# EAGLE design v1 (EAGLE 9.5.2)
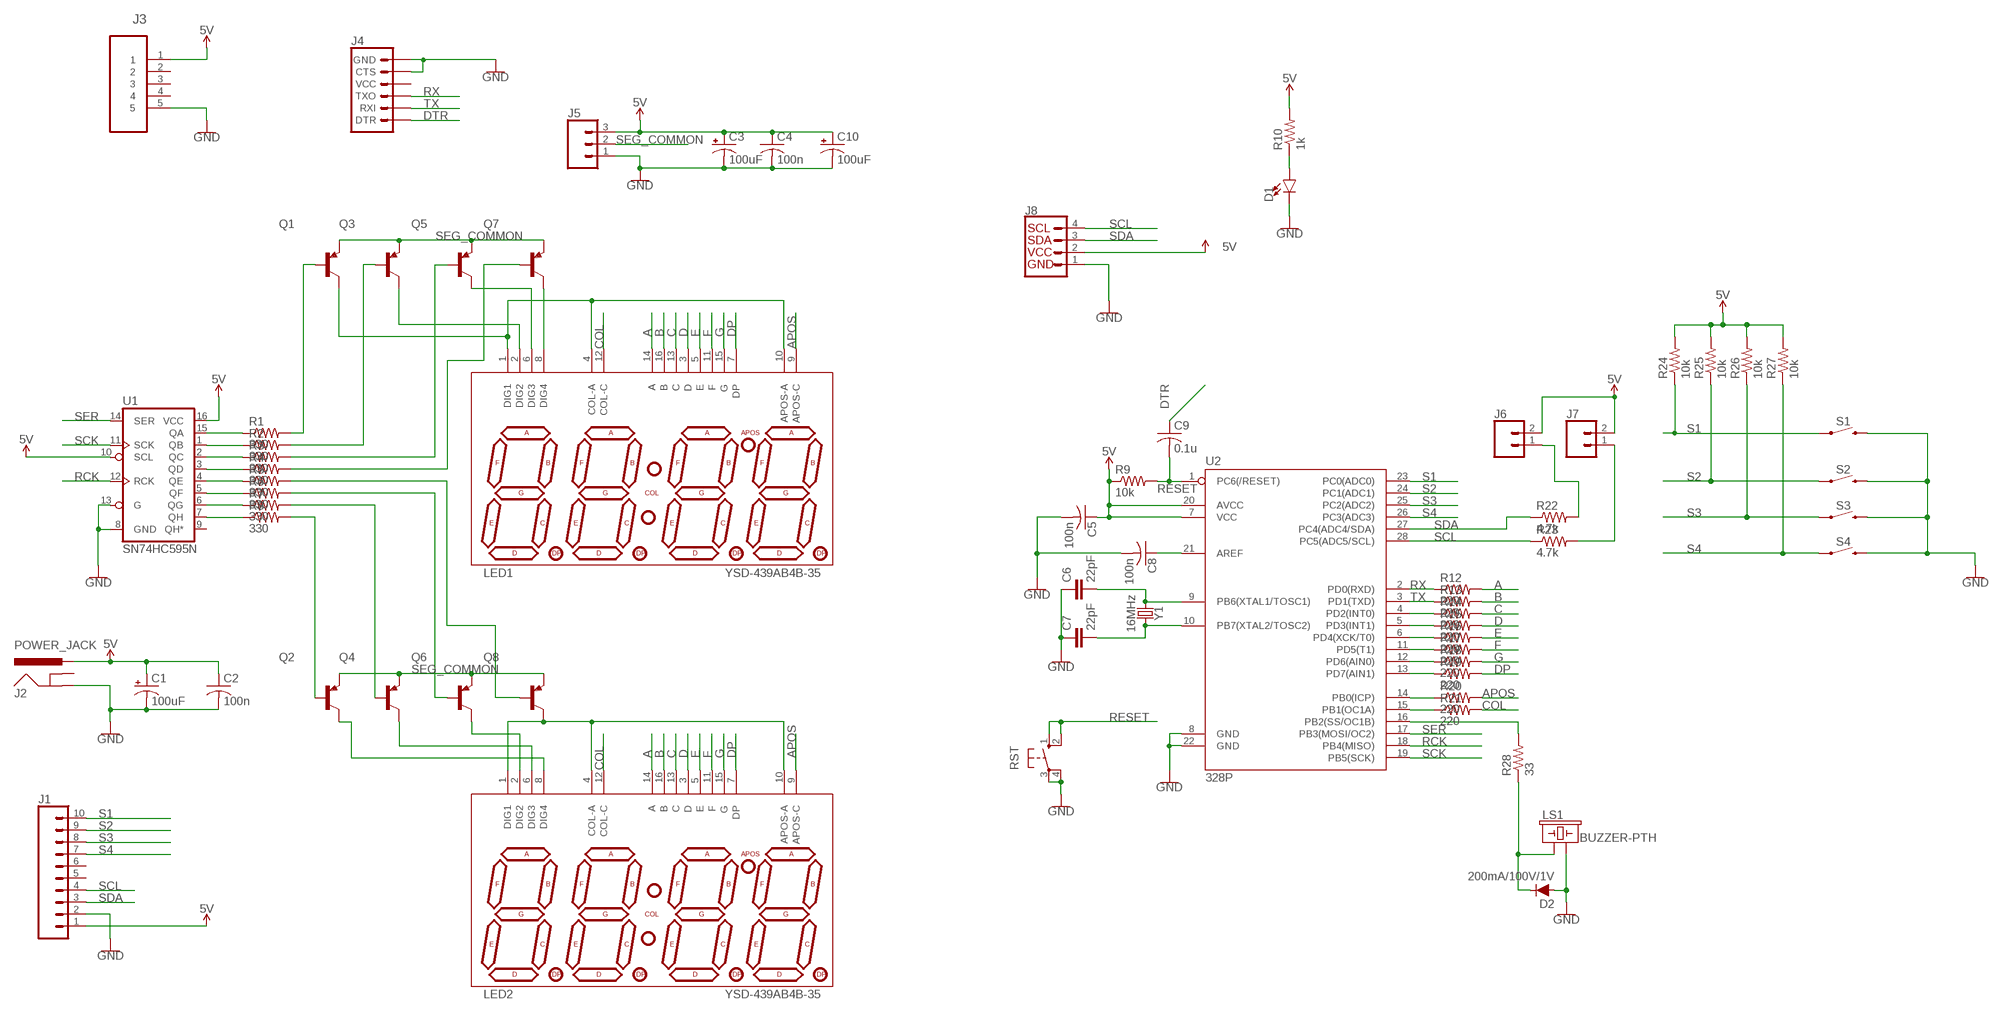
[diagram p0: schematic, sheet 1]

## Parts
C1  100uF  100UF-POLAR-RADIAL-2.5MM-25V-20%  [CPOL-RADIAL-2.5MM-6.5MM]
C2  100n  C-US025-025X050  [C025-025X050]
C3  100uF  100UF-POLAR-RADIAL-2.5MM-25V-20%  [CPOL-RADIAL-2.5MM-6.5MM]
C4  100n  C-US025-025X050  [C025-025X050]
C5  100n  C-US025-025X050  [C025-025X050]
C6  22pF  22PF-PTH-2.54MM-200V-5%  [CAP-PTH-2.54]
C7  22pF  22PF-PTH-2.54MM-200V-5%  [CAP-PTH-2.54]
C8  100n  C-US025-025X050  [C025-025X050]
C9  0.1u  C-US025-025X050  [C025-025X050]
C10  100uF  100UF-POLAR-RADIAL-2.5MM-25V-20%  [CPOL-RADIAL-2.5MM-6.5MM]
D1  LED3MM  [LED_3MM]
D2  200mA/100V/1V  DIODE-1N4148  [DIODE-1N4148]
J1  CONN_10"  [1X10]
J2  POWER_JACK  [POWER_JACK_PTH]
J3  47346-0001  [MOLEX_47346-0001]
J4  6_PIN_SERIAL_TARGET  [1X06]
J5  CONN_03  [1X03]
J6  CONN_02  [1X02]
J7  CONN_02  [1X02]
J8  I2C_STANDARD  [1X04]
LED1  YSD-439AB4B-35  7-SEGMENT-4DIGIT-10MM-BLUE  [7-SEGMENT-4DIGIT-YOUNGSUN]
LED2  YSD-439AB4B-35  7-SEGMENT-4DIGIT-10MM-BLUE  [7-SEGMENT-4DIGIT-YOUNGSUN]
LS1  BUZZER-PTH  [BUZZER-12MM]
Q1  2N3906  [TO92]
Q2  2N3906  [TO92]
Q3  2N3906  [TO92]
Q4  2N3906  [TO92]
Q5  2N3906  [TO92]
Q6  2N3906  [TO92]
Q7  2N3906  [TO92]
Q8  2N3906  [TO92]
R1  330  R-US_0204/5  [0204/5]
R2  330  R-US_0204/5  [0204/5]
R3  330  R-US_0204/5  [0204/5]
R4  330  R-US_0204/5  [0204/5]
R5  330  R-US_0204/5  [0204/5]
R6  330  R-US_0204/5  [0204/5]
R7  330  R-US_0204/5  [0204/5]
R8  330  R-US_0204/5  [0204/5]
R9  10k  R-US_0204/5  [0204/5]
R10  1k  R-US_0204/5  [0204/5]
R12  220  R-US_0204/5  [0204/5]
R13  220  R-US_0204/5  [0204/5]
R14  220  R-US_0204/5  [0204/5]
R15  220  R-US_0204/5  [0204/5]
R16  220  R-US_0204/5  [0204/5]
R17  220  R-US_0204/5  [0204/5]
R18  220  R-US_0204/5  [0204/5]
R19  220  R-US_0204/5  [0204/5]
R20  220  R-US_0204/5  [0204/5]
R21  220  R-US_0204/5  [0204/5]
R22  4.7k  R-US_0204/5  [0204/5]
R23  4.7k  R-US_0204/5  [0204/5]
R24  10k  R-US_0204/5  [0204/5]
R25  10k  R-US_0204/5  [0204/5]
R26  10k  R-US_0204/5  [0204/5]
R27  10k  R-US_0204/5  [0204/5]
R28  33  R-US_0204/5  [0204/5]
RST  10-XX  [B3F-10XX]
S1  MOMENTARY-SWITCH-SPST-PTH-6.0MM  [TACTILE_SWITCH_PTH_6.0MM]
S2  MOMENTARY-SWITCH-SPST-PTH-6.0MM  [TACTILE_SWITCH_PTH_6.0MM]
S3  MOMENTARY-SWITCH-SPST-PTH-6.0MM  [TACTILE_SWITCH_PTH_6.0MM]
S4  MOMENTARY-SWITCH-SPST-PTH-6.0MM  [TACTILE_SWITCH_PTH_6.0MM]
U1  SN74HC595N  74HC595N  [DIP16]
U2  328P  ATMEGA328P_PDIP  [DIP28]
Y1  16MHz  CRYSTAL-16MHZPTH-HC49US  [HC49US]

## Nets
5V [SUPPLY]: C1.1(+) C2.1 C3.1(+) C4.1 C5.1 C10.1(+) J1.1 J2.PWR J3.1 J5.3 J6.2 J7.2 J8.2 R9.1 R10.2 R24.2 R25.2 R26.2 R27.2 U1.10(SCL) U1.16(VCC) U2.7(VCC) U2.20(AVCC)
A: LED1.14(A) LED2.14(A) R12.2
APOS: LED1.9(APOS-C) LED2.9(APOS-C) R20.2
B: LED1.16(B) LED2.16(B) R13.2
C: LED1.13(C) LED2.13(C) R14.2
COL: LED1.12(COL-C) LED2.12(COL-C) R21.2
D: LED1.3(D) LED2.3(D) R15.2
DP: LED1.7(DP) LED2.7(DP) R19.2
DTR: C9.1 J4.1(DTR)
E: LED1.5(E) LED2.5(E) R16.2
F: LED1.11(F) LED2.11(F) R17.2
G: LED1.15(G) LED2.15(G) R18.2
GND [SUPPLY]: C1.2(-) C2.2 C3.2(-) C4.2 C5.2 C6.1 C7.1 C8.2 C10.2(-) D1.K(C) D2.A J1.2 J2.GND J3.5 J4.5(CTS) J4.6(GND) J5.1 J8.1 LS1.- RST.3(P) RST.4(P1) S1.3 S2.3 S3.3 S4.3 U1.8(GND) U1.13(G) U2.8(GND) U2.22(GND)
N$1: D1.A R10.1
N$2: R21.1 U2.15(PB1(OC1A))
N$3: R14.1 U2.4(PD2(INT0))
N$4: R15.1 U2.5(PD3(INT1))
N$5: R16.1 U2.6(PD4(XCK/T0))
N$6: R17.1 U2.11(PD5(T1))
N$7: R18.1 U2.12(PD6(AIN0))
N$8: R19.1 U2.13(PD7(AIN1))
N$9: C6.2 U2.9(PB6(XTAL1/TOSC1)) Y1.1
N$10: C7.2 U2.10(PB7(XTAL2/TOSC2)) Y1.2
N$11: LED1.1(DIG1) LED1.4(COL-A) LED1.10(APOS-A) Q1.1(C)
N$12: LED1.6(DIG3) Q5.1(C)
N$13: LED1.2(DIG2) Q3.1(C)
N$14: R28.2 U2.16(PB2(SS/OC1B))
N$15: LED2.1(DIG1) LED2.4(COL-A) LED2.10(APOS-A) Q8.1(C)
N$16: D2.C LS1.+ R28.1
N$17: LED2.2(DIG2) Q6.1(C)
N$18: LED2.6(DIG3) Q4.1(C)
N$19: LED2.8(DIG4) Q2.1(C)
N$20: LED1.8(DIG4) Q7.1(C)
N$21: Q1.2(B) R1.2
N$22: Q3.2(B) R2.2
N$23: Q5.2(B) R3.2
N$24: Q7.2(B) R4.2
N$25: Q8.2(B) R5.2
N$26: Q6.2(B) R6.2
N$27: Q4.2(B) R7.2
N$28: Q2.2(B) R8.2
N$29: R1.1 U1.15(QA)
N$30: R2.1 U1.1(QB)
N$31: R3.1 U1.2(QC)
N$32: R4.1 U1.3(QD)
N$33: R5.1 U1.4(QE)
N$34: R6.1 U1.5(QF)
N$35: R7.1 U1.6(QG)
N$36: R8.1 U1.7(QH)
N$37: C8.1 U2.21(AREF)
N$39: J6.1 R22.2
N$40: J7.1 R23.2
N$46: R20.1 U2.14(PB0(ICP))
RCK: U1.12(RCK) U2.18(PB4(MISO))
RESET: C9.2 R9.2 RST.1(S) RST.2(S1) U2.1(PC6(/RESET))
RX: J4.3(TXO) R12.1 U2.2(PD0(RXD))
S1: J1.10 R24.1 S1.1 U2.23(PC0(ADC0))
S2: J1.9 R25.1 S2.1 U2.24(PC1(ADC1))
S3: J1.8 R26.1 S3.1 U2.25(PC2(ADC2))
S4: J1.7 R27.1 S4.1 U2.26(PC3(ADC3))
SCK: U1.11(SCK) U2.19(PB5(SCK))
SCL: J1.4 J8.4 R23.1 U2.28(PC5(ADC5/SCL))
SDA: J1.3 J8.3 R22.1 U2.27(PC4(ADC4/SDA))
SEG_COMMON [SUPPLY]: J5.2 Q1.3(E) Q2.3(E) Q3.3(E) Q4.3(E) Q5.3(E) Q6.3(E) Q7.3(E) Q8.3(E)
SER: U1.14(SER) U2.17(PB3(MOSI/OC2))
TX: J4.2(RXI) R13.1 U2.3(PD1(TXD))
Unconnected: J1.5 J1.6 J2.GNDBREAK J3.2 J3.3 J3.4 J4.4(VCC) U1.9(QH*)

## Library data of the parts
C1 C3 C10 = SparkFun-Capacitors:100UF-POLAR: 100µF polarized capacitors A capacitor is a passive two-terminal electrical component used to store electrical energy temporarily in an electric field.; PROD_ID: CAP-08439
C2 C4 C5 C8 C9 = adafruit:C-US: CAPACITOR, American symbol
C6 C7 = SparkFun-Capacitors:22PF: 22pF ceramic capacitors A capacitor is a passive two-terminal electrical component used to store electrical energy temporarily in an electric field.; PROD_ID: CAP-09128
D1 = SparkFun-LED:LED: LED (Generic) Standard schematic elements and footprints for 5mm, 3mm, 1206, and 0603 sized LEDs. Generic LEDs with no color specified.; PROD_ID: DIO-08794
D2 = SparkFun-DiscreteSemi:DIODE: Diode These are standard reverse protection diodes and small signal diodes. SparkFun Products: SparkFun SparkPunk Sound Kit <https://www.sparkfun.com/products/11177> SparkFun ESP8266 Thing <https://www.sparkfun.com/products/13231>; PROD_ID: DIO-08378
J1 = SparkFun-Connectors:CONN_10: Multi connection point. Often used as Generic Header-pin footprint for 0.1 inch spaced/style header connections On any of the 0.1 inch spaced packages, you can populate with these: Break Away Headers - Straight <https://www.sparkfun.com/products/116> (PRT-00116) Break Away Male Headers - Right Angle <https://www.sparkfun.com/products/553> (PRT-00553) Female Headers <https://www.sparkfun.com/products/115> (PRT-00115) Break Away Headers - Machine Pin <https://www.sparkfun.com/products/117> (PRT-00117) Break Away Female Headers - Swiss Machine Pin <https://www.sparkfun.com/products/743> (PRT-00743) Arduino Stackable Header - 10 Pin <https://www.sparkfun.com/products/11376> (PRT-11376) For SCREWTERMINALS and SPRING TERMINALS visit here: Screw Terimnals on SparkFun.com <https://www.sparkfun.com/search/results?term=Screw+Terminals> (5mm/3.5mm/2.54mm spacing) This device is also useful as a general connection point to wire up your design to another part of your project. Our various solder wires solder well into these plated through hole pads. Hook-Up Wire - Assortment (Stranded, 22 AWG) <https://www.sparkfun.com/products/11375> (PRT-11375) Hook-Up Wire - Assortment (Solid Core, 22 AWG) <https://www.sparkfun.com/products/11367> (PRT-11367) View the entire wire category on our website here <https://www.sparkfun.com/categories/141> Special notes: Molex polarized connector foot print use with SKU : PRT-08231 with associated crimp pins and housings. 1MM SMD Version SKU: PRT-10208 NOTES ON THE VARIANTS LOCK and LOCK_LONGPADS... This footprint was designed to help hold the alignment of a through-hole component (i.e. 6-pin header) while soldering it into place. You may notice that each hole has been shifted either up or down by 0.005 of an inch from it's more standard position (which is a perfectly straight line). This slight alteration caused the pins (the squares in the middle) to touch the edges of the holes. Because they are alternating, it causes a "brace" to hold the component in place. 0.005 has proven to be the perfect amount of "off-center" position when using our standard breakaway headers. Although looks a little odd when you look at the bare footprint, once you have a header in there, the alteration is very hard to notice. Also,if you push a header all the way into place, it is covered up entirely on the bottom side.; PROD_ID: CONN-11563
J2 = SparkFun-Connectors:POWER_JACK: Power Jack Connector This is the standard 5.5mm barrel jack for power. The PTH is the most common, proven, reliable, footprint. The Slot footprint only works if the mill layer is transmitted to the PCB fab house so be warned. Here are the connectors we sell at SparkFun: DC Barrel Power Jack/Connector <https://www.sparkfun.com/products/119> (PRT-00119) DC Barrel Power Jack/Connector (SMD) <https://www.sparkfun.com/products/12748> (PRT-12748) DC Barrel Jack Adapter - Breadboard Compatible <https://www.sparkfun.com/products/10811> (PRT-10811) It is used on this SparkFun product (and many, many others): SparkFun RedBoard - Programmed with Arduino <https://www.sparkfun.com/products/12757> (DEV-12757) Also, if you need a mating power supply or connector, please check these out: Wall Adapter Power Supply - 9VDC 650mA <https://www.sparkfun.com/products/298> (TOL-00298) DC Barrel Jack Adapter - Male <https://www.sparkfun.com/products/10287> (PRT-10287); PROD_ID: CONN-08197
J3 = Molex-47346-0001:47346-0001: CONN RCPT 5POS MICRO USB R/A SMD; MPN: 47346-0001; OC_FARNELL: 1568026; OC_NEWARK: 47M0505; PACKAGE: 5 POS MICRO USB R/A; SUPPLIER: MOLEX
J4 = SparkFun-Connectors:6_PIN_SERIAL_TARGET: 6-pin header connection for use with the "FTDI BASIC" pinout - TARGET SIDE. Also known as "Arduino Serial Program Header". It is used to mate with our FTDI Basic serial programmers using the Arduino IDE. Note, this device has "TARGET" in the name. It is intended to be used on a design that contains a target micro-controller that you wish to program. The "sister" device, named "CABLE" is inteneded to be used on a design that usually lives on the end of your USB cable and prvides the converter chip (FTDI232 or FTDI231x) to commnicate serial RX/TX. You can populate with some of these: Break Away Headers - Straight <https://www.sparkfun.com/products/116> (PRT-00116) For reference (or to suit your programming needs) check out these designs: SparkFun FTDI Basic Breakout - 5V <https://www.sparkfun.com/products/9716> (DEV-09716) SparkFun FTDI Basic Breakout - 3.3V <https://www.sparkfun.com/products/9873> (DEV-09873) SparkFun FTDI SmartBasic <https://www.sparkfun.com/products/12935> (DEV-12935) SparkFun Beefy 3 - FTDI Basic Breakout <https://www.sparkfun.com/products/13746> (DEV-13746)
J5 = SparkFun-Connectors:CONN_03: Multi connection point. Often used as Generic Header-pin footprint for 0.1 inch spaced/style header connections On any of the 0.1 inch spaced packages, you can populate with these: Break Away Headers - Straight <https://www.sparkfun.com/products/116> (PRT-00116) Break Away Male Headers - Right Angle <https://www.sparkfun.com/products/553> (PRT-00553) Female Headers <https://www.sparkfun.com/products/115> (PRT-00115) Break Away Headers - Machine Pin <https://www.sparkfun.com/products/117> (PRT-00117) Break Away Female Headers - Swiss Machine Pin <https://www.sparkfun.com/products/743> (PRT-00743) Stackable Header - 3 Pin (Female, 0.1") <https://www.sparkfun.com/products/13875> (PRT-13875) For SCREWTERMINALS and SPRING TERMINALS visit here: Screw Terimnals on SparkFun.com <https://www.sparkfun.com/search/results?term=Screw+Terminals> (5mm/3.5mm/2.54mm spacing) This device is also useful as a general connection point to wire up your design to another part of your project. Our various solder wires solder well into these plated through hole pads. Hook-Up Wire - Assortment (Stranded, 22 AWG) <https://www.sparkfun.com/products/11375> (PRT-11375) Hook-Up Wire - Assortment (Solid Core, 22 AWG) <https://www.sparkfun.com/products/11367> (PRT-11367) View the entire wire category on our website here <https://www.sparkfun.com/categories/141> Special notes: Molex polarized connector foot print use with SKU : PRT-08232 with associated crimp pins and housings.
J6 J7 = SparkFun-Connectors:CONN_02: Multi connection point. Often used as Generic Header-pin footprint for 0.1 inch spaced/style header connections On any of the 0.1 inch spaced packages, you can populate with these: Break Away Headers - Straight <https://www.sparkfun.com/products/116> (PRT-00116) Break Away Male Headers - Right Angle <https://www.sparkfun.com/products/553> (PRT-00553) Female Headers <https://www.sparkfun.com/products/115> (PRT-00115) Break Away Headers - Machine Pin <https://www.sparkfun.com/products/117> (PRT-00117) Break Away Female Headers - Swiss Machine Pin <https://www.sparkfun.com/products/743> (PRT-00743) For SCREWTERMINALS and SPRING TERMINALS visit here: Screw Terimnals on SparkFun.com <https://www.sparkfun.com/search/results?term=Screw+Terminals> (5mm/3.5mm/2.54mm spacing) This device is also useful as a general connection point to wire up your design to another part of your project. Our various solder wires solder well into these plated through hole pads. Hook-Up Wire - Assortment (Stranded, 22 AWG) <https://www.sparkfun.com/products/11375> (PRT-11375) Hook-Up Wire - Assortment (Solid Core, 22 AWG) <https://www.sparkfun.com/products/11367> (PRT-11367) View the entire wire category on our website here <https://www.sparkfun.com/categories/141> Special notes: Molex polarized connector foot print use with: PRT-08233 with associated crimp pins and housings. 2.54_SCREWTERM for use with PRT-10571. 3.5mm Screw Terminal footprints for PRT-08084 5mm Screw Terminal footprints for use with PRT-08432
J8 = SparkFun-Connectors:I2C_STANDARD: SparkFun I2C Standard Pinout Header SparkFun has standardized on a pinout for all I2C based sensor breakouts. This pinout allows I2C boards to be plugged directly into the headers on Arduino Uno compatible boards, and to be daisy chained easily. Example SparkFun Products: SparkFun Atmospheric Sensor Breakout - BME280 <https://www.sparkfun.com/products/13676> SparkFun Altitude/Pressure Sensor Breakout - MPL3115A2 <https://www.sparkfun.com/products/11084> SparkFun TOF Range Finder Sensor - VL6180 <https://www.sparkfun.com/products/12785>
LED1 LED2 = SparkFun-LED:7-SEGMENT-4DIGIT-10MM: 4 Digit 7 Segment Display This is a part for the 4-Digit 7-segment LEDs from Young Sun. Different from the Digikey LEDs, all 16 pins are used. The LONGPADS Variant is used for a test jig, but you may like it because there is more pad to solder to. If you are concerned about routing space, the standard works just fine though. Datasheets: Red <http://www.sparkfun.com/datasheets/Components/LED/7-Segment/YSD-439AR6B-35.pdf> Yellow <http://www.sparkfun.com/datasheets/Components/LED/7-Segment/YSD-439AY2B-35.pdf> Kelly Green <http://www.sparkfun.com/datasheets/Components/LED/7-Segment/YSD-439AK2B-35.pdf> Blue <http://www.sparkfun.com/datasheets/Components/LED/7-Segment/YSD-439AB4B-35.pdf> White <http://cdn.sparkfun.com/datasheets/Components/LED/ATA3492BW_2.pdf> SparkFun Products Raw Components 7-Segment Display - 4-Digit (Red) <https://www.sparkfun.com/products/9483> (COM-09483) 7-Segment Display - 4-Digit (Yellow) <https://www.sparkfun.com/products/9480> (COM-09480) 7-Segment Display - 4-Digit (Kelly Green) <https://www.sparkfun.com/products/9482> (COM-09482) 7-Segment Display - 4-Digit (Blue) <https://www.sparkfun.com/products/9481> (COM-09481) 7-Segment Display - 4-Digit (White) <https://www.sparkfun.com/products/10931> ( COM-10931) Serial Controlled SparkFun 7-Segment Serial Display - Red <https://www.sparkfun.com/products/11441> (COM-11441) SparkFun 7-Segment Serial Display - Yellow <https://www.sparkfun.com/products/11443> (COM-11443) SparkFun 7-Segment Serial Display - Kelly Green <https://www.sparkfun.com/products/11440> (COM-11440) SparkFun 7-Segment Serial Display - Blue <https://www.sparkfun.com/products/11442> (COM-11442) SparkFun 7-Segment Serial Display - White <https://www.sparkfun.com/products/11629> (COM-11629) Other SparkFun BigTime Watch Kit <https://www.sparkfun.com/products/11734> (KIT-11734); PROD_ID: COMP-09664
LS1 = SparkFun-Electromechanical:BUZZER: Buzzer Small round buzzers that operate around the audible 2kHz range. You can use these as speakers to create simple music or user interfaces. Variant Overview: PTH - Mini Speaker - PC Mount 12mm 2.048kHz <https://www.sparkfun.com/products/7950> PTH_KIT - Mini Speaker - PC Mount 12mm 2.048kHz <https://www.sparkfun.com/products/7950> KIT simplifies soldering by adding stop mask to one side of the pads. PTH_NO_SILK - Mini Speaker - PC Mount 12mm 2.048kHz <https://www.sparkfun.com/products/7950> No silkscreen indicator of buzzer outline. PTH_KIT_NO_SILK - Mini Speaker - PC Mount 12mm 2.048kHz <https://www.sparkfun.com/products/7950> KIT package w/o silkscreen SMD - Buzzer Audio Magnetic (CCV-084B16) SMD buzzer used on, e.g. the LilyPad Buzzer <https://www.sparkfun.com/products/8463> and RFID USB Reader <https://www.sparkfun.com/products/9963>. SMD_KIT - Buzzer Audio Magnetic (CCV-084B16) SMD Buzzer with elongated pins to make soldering easier. Used on the SparkFun Simon Says - Surface Mount Soldering Kit <https://www.sparkfun.com/products/10935>.; PROD_ID: COMP-08253; SF_SKU: COM-07950
Q1-Q8 = transistor-pnp:2N3906: PNP Transistor
R1-R10 R12-R28 = rcl:R-US_: RESISTOR, American symbol
RST = switch-omron:10-XX: OMRON SWITCH; MPN: B3F-1000; OC_FARNELL: 176432; OC_NEWARK: 36M3542
S1-S4 = SparkFun-Switches:MOMENTARY-SWITCH-SPST: Momentary Switch (Pushbutton) - SPST Normally-open (NO) SPST momentary switches (buttons, pushbuttons). Variants PTH-12MM - 12mm square, through-hole Momentary Pushbutton Switch - 12mm Square <https://www.sparkfun.com/products/9190> (COM-09190) PTH-6.0MM, PTH-6.0MM-KIT - 6.0mm square, through-hole Mini Pushbutton Switch <https://www.sparkfun.com/products/97> (COM-00097) KIT package intended for soldering kit's - only one side of pads' copper is exposed. PTH-RIGHT-ANGLE-KIT - Right-angle, through-hole Right Angle Tactile Button <https://www.sparkfun.com/products/10791> - Used on SparkFun BigTime Watch Kit <https://www.sparkfun.com/products/11734> SMD-12MM - 12mm square, surface-mount Tactile Button - SMD (12mm) <https://www.sparkfun.com/products/12993> (COM-12993) Used on SparkFun PicoBoard <https://www.sparkfun.com/products/11888> SMD-4.5MM - 4.5mm Square Trackball Switch Used on SparkFun Blackberry Trackballer Breakout <https://www.sparkfun.com/products/13169> SMD-4.6MMX2.8MM - 4.60mm x 2.80mm, surface mount Used on SparkFun SAMD21 Mini Breakout <https://www.sparkfun.com/products/13664> SMD-5.2MM, SMD-5.2-REDUNDANT - 5.2mm square, surface-mount Mini Pushbutton Switch - SMD <https://www.sparkfun.com/products/8720> (COM-08720) Used on Arduino Pro Mini <https://www.sparkfun.com/products/11114> REDUNDANT package connects both switch circuits together SMD-6.0X3.5MM - 6.0 x 3.5mm, surface mount Momentary Reset Switch SMD <https://www.sparkfun.com/products/8229> (COM-08229) SMD-6.2MM-TALL - 6.2mm square, surface mount Tactile Button - SMD (6mm) <https://www.sparkfun.com/products/12992> Used on SparkFun Digital Sandbox <https://www.sparkfun.com/products/12651> SMD-RIGHT-ANGLE - Right-angle, surface mount Used on SparkFun Block for Intel® Edison - Arduino <https://www.sparkfun.com/products/13036>; PROD_ID: SWCH-08441; SF_SKU: COM-00097
U1 = SparkFun-IC-Logic:74*595: 8-Bit Shift Register (Serial to Parallel) Datasheet <http://cdn.sparkfun.com/datasheets/BreakoutBoards/MM74HC595.pdf> SparkFun Products SparkFun Shift Register Breakout - 74HC595 <https://www.sparkfun.com/products/10680> (BOB-10680); PROD_ID: IC-13123
U2 = SparkFun-IC-Microcontroller:ATMEGA328P_PDIP: Atmel 328P Through hole ATMEGA328P uC used in the Arduino 32kb flash, 1k EEPROM, 2k SRAM Datasheet <http://www.sparkfun.com/datasheets/Components/SMD/ATMega328.pdf> SparkFun Products Storefront component: AVR 28 Pin 20MHz 32K 6A/D - ATMega328P <https://www.sparkfun.com/products/9061> (COM-09061) SparkFun Simon Says - Through-Hole Soldering Kit <https://www.sparkfun.com/products/10547> (KIT-10547) SparkFun Learn to Solder - Simon Says <https://www.sparkfun.com/products/13708> (KIT-13708) SparkFun BigTime Watch Kit <https://www.sparkfun.com/products/11734> (KIT-11734) SparkFun ClockIt <https://www.sparkfun.com/products/10930> (KIT-10930) SparkFun Serial Enabled LCD Kit <https://www.sparkfun.com/products/10097> (LCD-10097) SparkFun Simon Tilts - Through Hole Soldering Kit <https://www.sparkfun.com/products/12634> (KIT-12634) SparkFun Frequency Counter Kit <https://www.sparkfun.com/products/10140> (KIT-10140) FabFM Radio Kit <https://www.sparkfun.com/products/11043> (KIT-11043) SparkFun Binary Blaster Kit <https://www.sparkfun.com/products/12037> (KIT-12037) SparkFun Metro-Gnome <https://www.sparkfun.com/products/9236> (KIT-09236) ATmega328 with Arduino Optiboot (Uno) <https://www.sparkfun.com/products/10524> (DEV-10524); PROD_ID: IC-09136
Y1 = SparkFun-Clocks:CRYSTAL-16MHZ: 16MHz Crystal Digikey Example <http://www.digikey.com/product-search/en?keywords=535-9122-1-ND> Frequency: 16MHz Frequency Stability: ±50ppm Frequency Tolerance: ±20ppm Load Capacitance: 18pF SparkFun Products: Pro Micro -5V/16MHz <https://www.sparkfun.com/products/12640> SparkFun Serial Enabled LCD Kit <https://www.sparkfun.com/products/10097>; PROD_ID: XTAL-08181; SF_ID: COM-00536

## Net classes
0 default: width 0.254 mm, drill 0.356 mm, clearance 0.2 mm
1 SUPPLY: width 0.4 mm, drill 0.6 mm, clearance 0.2 mm to class 0, clearance 0.2 mm

## Board
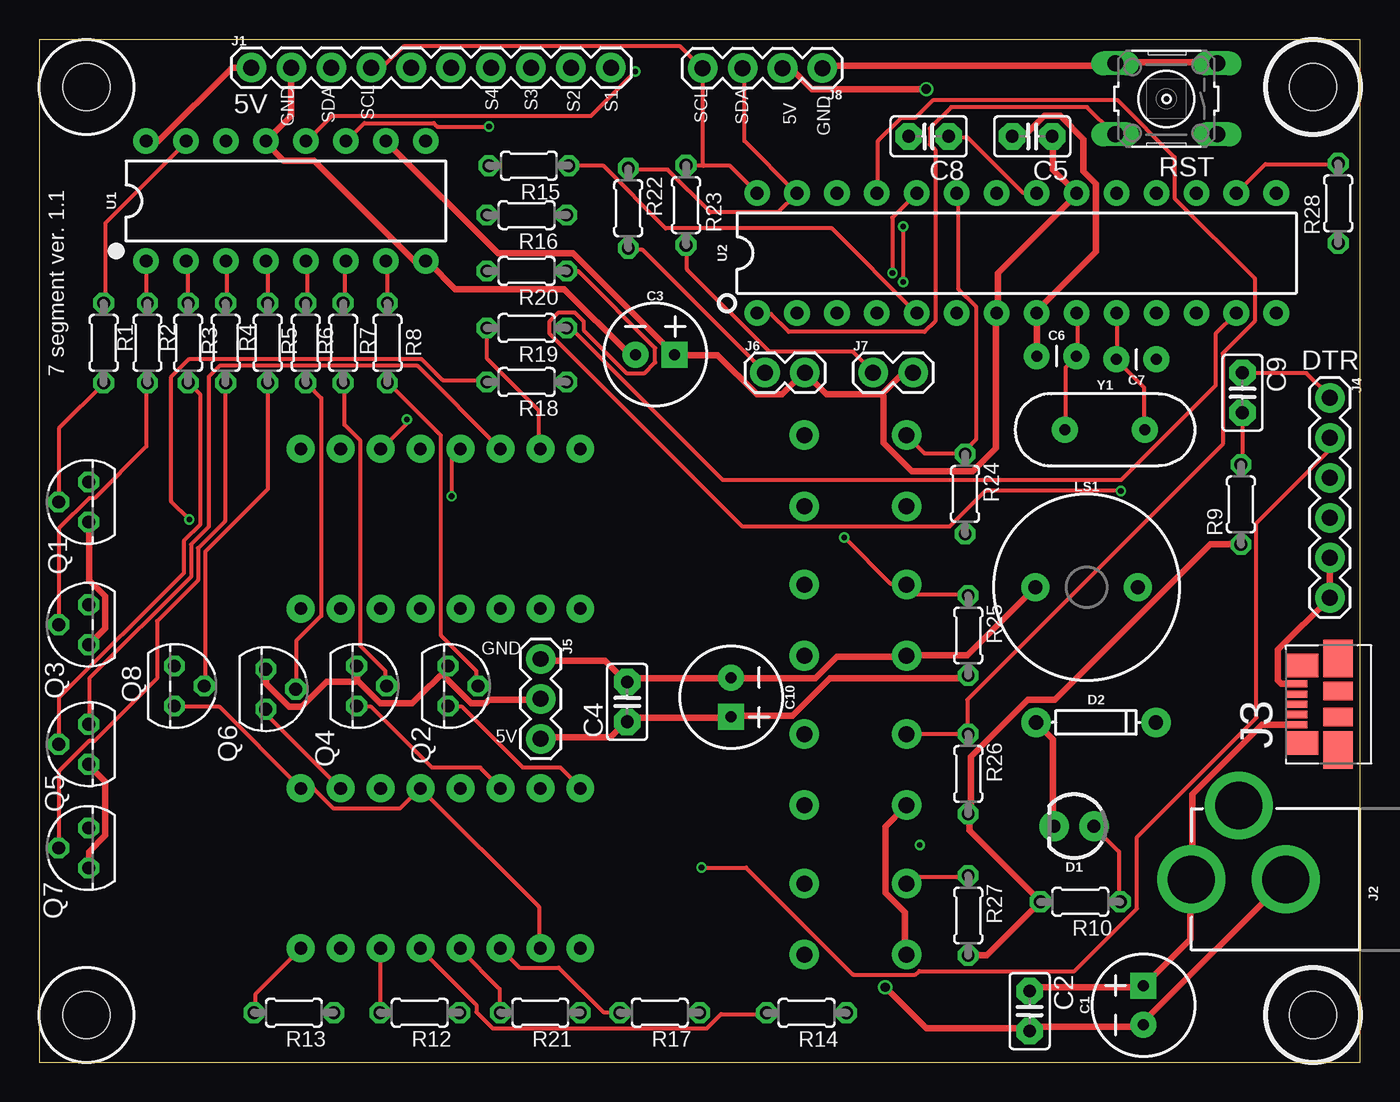
[diagram p1: board, top side]
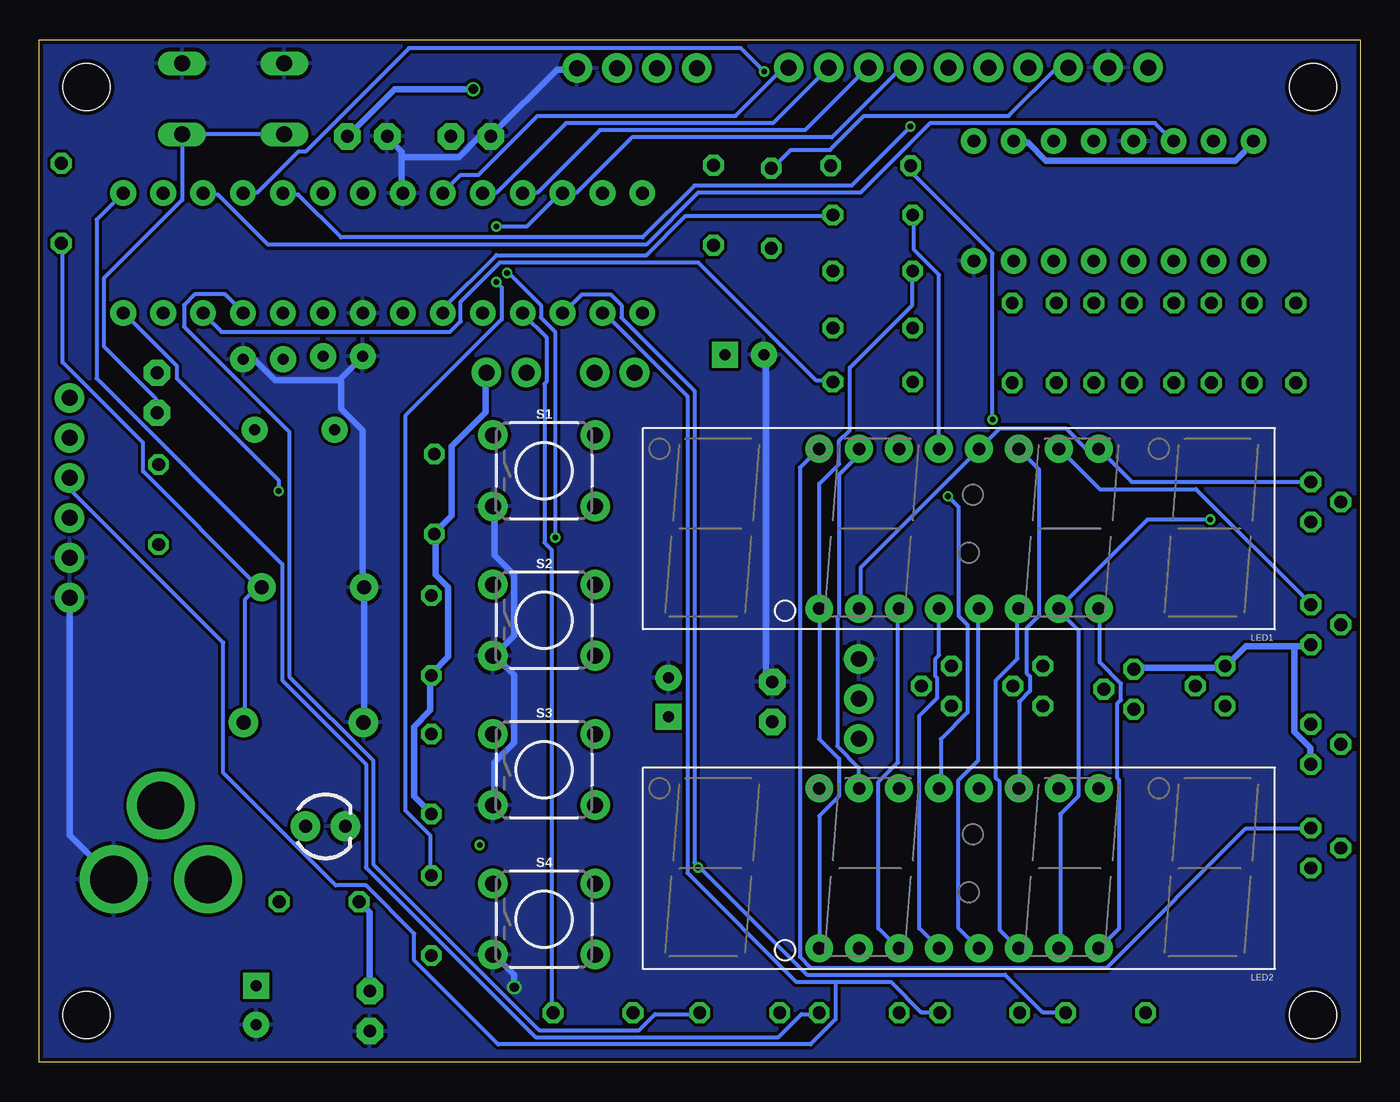
[diagram p2: board, bottom side, seen from below]

Size 84 x 65 mm. Coordinates in mm from the lower left corner, seen from the top.
Outline: 0,0 84,0 84,65 0,65 0,0
Copper layers (1*16): Top 0.035mm / dielectric 1.5mm / Bottom 0.035mm
Design rules "SeeedStudio_2layer_DRU_no_angle_20140221": minimum track width 6mil, minimum drill 12mil, track to track 6mil, track to pad 6mil, pad to pad 6mil, via to via 6mil, smd to smd 0mil, copper to edge 10mil, drill to drill 10mil, minimum pad ring 10mil, minimum via ring 6mil, stop-mask expansion 2mil, vias tented up to drill 100mil, thermal gap 10mil
Holes 3 mm at 3,3 81,3 81,62 3,62

### Footprints (pad centres in the part's own frame; a part is rotated, then mirrored left to right if it is on the bottom)
CPOL-RADIAL-2.5MM-6.5MM = drill 0.7 pad 1.651 square: 1 1.25,0 | drill 0.7 pad 1.651: 2 -1.25,0
C025-025X050 = drill 0.813 pad 1.676 octagon: 1 -1.27,0; 2 1.27,0
CAP-PTH-2.54 = drill 0.7 pad 1.651: 1 -1.27,0; 2 1.27,0
LED_3MM = drill 0.813 pad 1.88: A -1.27,0; K 1.27,0
DIODE-1N4148 = drill 0.9 pad 1.88: A -3.81,0; C 3.81,0
1X10 = drill 1.016 pad 1.88: 1 0,0; 2 2.54,0; 3 5.08,0; 4 7.62,0; 5 10.16,0; 6 12.7,0; 7 15.24,0; 8 17.78,0; 9 20.32,0; 10 22.86,0
POWER_JACK_PTH = drill 2.997 pad 4.318: GND 0,7.7; GNDBREAK 4.7,10.7; PWR 0,13.7
MOLEX_47346-0001 = smd 0.45 x 1.38: 1 -1.3,0; 2 -0.65,0; 3 0,0; 4 0.65,0; 5 1.3,0 | smd 1.475 x 2.1: M1 -2.462,-0.36; M2 2.462,-0.36 | smd 2.375 x 1.9: M3 -2.913,-2.66; M6 2.913,-2.66 | smd 1.175 x 1.9: M4 -0.82,-2.66; M5 0.85,-2.66
1X06 = drill 1.016 pad 1.88: 1 0,0; 2 2.54,0; 3 5.08,0; 4 7.62,0; 5 10.16,0; 6 12.7,0
1X03 = drill 1.016 pad 1.88: 1 0,0; 2 2.54,0; 3 5.08,0
1X02 = drill 1.016 pad 1.88: 1 0,0; 2 2.54,0
1X04 = drill 1.016 pad 1.88: 1 0,0; 2 2.54,0; 3 5.08,0; 4 7.62,0
7-SEGMENT-4DIGIT-YOUNGSUN = drill 0.8 pad 1.778: 1 -8.89,-5.08; 2 -6.35,-5.08; 3 -3.81,-5.08; 4 -1.27,-5.08; 5 1.27,-5.08; 6 3.81,-5.08; 7 6.35,-5.08; 8 8.89,-5.08; 9 8.89,5.08; 10 6.35,5.08; 11 3.81,5.08; 12 1.27,5.08; 13 -1.27,5.08; 14 -3.81,5.08; 15 -6.35,5.08; 16 -8.89,5.08
BUZZER-12MM = drill 0.9 pad 1.778: + 3.25,0; - -3.25,0
TO92 = drill 0.813 octagon: 1 1.27,0; 2 0,1.905; 3 -1.27,0
0204/5 = drill 0.813 octagon: 1 -2.54,0; 2 2.54,0
B3F-10XX = drill 1.016 long: 1 -3.251,2.261; 2 3.251,2.261; 3 -3.251,-2.261; 4 3.251,-2.261
TACTILE_SWITCH_PTH_6.0MM = drill 1.016 pad 1.88: 1 -3.251,2.261; 2 3.251,2.261; 3 -3.251,-2.261; 4 3.251,-2.261
DIP16 = drill 0.813 pad 1.626: 1 -8.89,-3.81; 2 -6.35,-3.81; 3 -3.81,-3.81; 4 -1.27,-3.81; 5 1.27,-3.81; 6 3.81,-3.81; 7 6.35,-3.81; 8 8.89,-3.81; 9 8.89,3.81; 10 6.35,3.81; 11 3.81,3.81; 12 1.27,3.81; 13 -1.27,3.81; 14 -3.81,3.81; 15 -6.35,3.81; 16 -8.89,3.81
DIP28 = drill 0.813 pad 1.626: 1 -16.51,-3.81; 2 -13.97,-3.81; 3 -11.43,-3.81; 4 -8.89,-3.81; 5 -6.35,-3.81; 6 -3.81,-3.81; 7 -1.27,-3.81; 8 1.27,-3.81; 9 3.81,-3.81; 10 6.35,-3.81; 11 8.89,-3.81; 12 11.43,-3.81; 13 13.97,-3.81; 14 16.51,-3.81; 15 16.51,3.81; 16 13.97,3.81; 17 11.43,3.81; 18 8.89,3.81; 19 6.35,3.81; 20 3.81,3.81; 21 1.27,3.81; 22 -1.27,3.81; 23 -3.81,3.81; 24 -6.35,3.81; 25 -8.89,3.81; 26 -11.43,3.81; 27 -13.97,3.81; 28 -16.51,3.81
HC49US = drill 0.7 pad 1.651: 1 -2.54,0; 2 2.54,0

### Placement (x,y rotation side)
C1  70.22,3.62 90 top
C2  62.98,3.25 270 top
C3  39.16,44.98 0 top
C4  37.39,22.91 90 top
C5  63.14,58.86 180 top
C6  64.69,44.89 0 top
C7  69.77,44.69 180 top
C8  56.55,58.86 180 top
C9  76.51,42.56 270 top
C10  44,23.2 270 top
D1  65.8,15 180 top
D2  67.2,21.6 0 top
J1  13.48,63.23 0 top
J2  86.97,11.62 90 top
J3  79.93,22.75 90 top
J4  82.07,42.23 270 top
J5  31.89,25.63 270 top
J6  46.15,43.84 0 top
J7  53.03,43.84 0 top
J8  49.8,63.2 180 top
LED1  25.51,33.91 180 bottom
LED2  25.51,12.32 180 bottom
LS1  66.6,30.2 0 top
Q1  3.14,35.62 90 top
Q2  26,23.91 270 top
Q3  3.14,27.82 90 top
Q4  20.18,23.91 270 top
Q5  3.14,20.21 90 top
Q6  14.4,23.71 270 top
Q7  3.14,13.62 90 top
Q8  8.59,23.91 270 top
R1  4.09,45.73 270 top
R2  6.88,45.73 270 top
R3  9.46,45.73 270 top
R4  11.85,45.73 270 top
R5  14.53,45.73 270 top
R6  16.94,45.73 270 top
R7  19.32,45.73 270 top
R8  22.14,45.73 270 top
R9  76.42,35.46 90 top
R10  66.2,10.2 180 top
R12  24.19,3.15 180 top
R13  16.19,3.15 180 top
R14  48.79,3.14 180 top
R15  31.13,57 180 top
R16  30.99,53.86 180 top
R17  39.46,3.15 180 top
R18  30.99,43.24 180 top
R19  30.99,46.68 180 top
R20  30.99,50.3 180 top
R21  31.86,3.15 180 top
R22  37.45,54.29 270 top
R23  41.13,54.48 270 top
R24  58.87,36.12 270 top
R25  59.07,27.12 270 top
R26  59.07,18.32 270 top
R27  59.07,9.32 270 top
R28  82.6,54.6 90 top
RST  71.68,61.24 180 top
S1  51.9,37.6 0 bottom
S2  51.9,28.1 0 bottom
S3  51.9,18.6 0 bottom
S4  51.9,9.1 0 bottom
U1  15.68,54.75 0 top
U2  62.15,51.44 0 top
Y1  67.76,40.21 0 top

### Tracks (layer width: path | path; a pad name or v marks a point on that pad's centre or on a via)
5V  (via drill 0.6)
  Top 0.4: C5.1 64.47,58.79 64.47,56.75 65.83,55.39 U2.20 65.94,55.16 60.95,50.17 60.95,47.67 U2.7 60.84,47.44 60.84,39.04 59.36,37.57 55.5,37.57 53.69,39.38 53.69,42.34 53.57,42.45 | v56.41,61.86 49.15,61.86 47.9,63.11 47.33,63.11 J8.2 | J3.1 79.9,21.45 77.75,21.45 73.32,17.02 73.32,11.69 J2.PWR 73.21,11.46 73.21,7.83 70.37,4.99 C1.1 70.14,4.77 63.22,4.77 62.99,4.54 C2.1 | U1.16 6.81,58.57 7.6,58.57 12.26,63.22 13.39,63.22 J1.1 | 53.57,42.45 54.93,43.81 55.5,43.81 J7.2 | 53.57,42.45 50.05,42.45 48.8,43.7 J6.2 48.58,43.81 47.22,42.45 45.63,42.45 43.13,44.95 40.52,44.95 C3.1 40.29,45.06 33.94,51.42 29.17,51.42 22.13,58.45 U1.10 | J5.3 31.89,20.66 36.32,20.66 37.23,21.57 C4.1 37.45,21.68 37.68,21.91 43.92,21.91 C10.1 44.15,22.02 47.9,22.02 50.28,24.4 58.91,24.4 59.02,24.52 R25.2 | R27.2 59.13,6.81 60.27,6.81 63.56,10.1 R10.2 63.56,10.33 59.13,14.76 59.13,15.78 R26.2 59.25,15.89 59.25,19.41 62.88,23.04 64.58,23.04 74.46,32.91 76.39,32.91 R9.1
  Bottom 0.4: v56.41,61.86 61.4,61.86 64.36,58.91 C5.1 | U1.10 22.02,58.45 21.11,58.45 19.98,57.32 7.95,57.32 6.81,58.45 U1.16 | R26.2 59.13,15.89 60.16,16.91 60.16,21.34 59.13,22.36 59.13,24.52 R25.2 59.02,24.74 58,25.77 58,30.19 58.79,30.98 58.79,33.48 R24.2 58.79,33.71 57.77,34.73 57.77,39.16 55.62,41.31 55.62,43.81 J7.2 | C2.1 62.99,4.54 62.99,9.53 63.56,10.1 R10.2
A
  Top 0.254: R12.2 21.68,3.18 21.68,7.15 LED2.14
  Bottom 0.254: LED1.14 21.79,28.83 21.79,25.65 23.15,24.29 23.15,18.05 22.93,17.82 22.93,8.4 21.79,7.26 LED2.14
APOS
  Bottom 0.254: R20.2 28.49,50.28 28.49,48.12 32.46,44.15 32.46,40.18 33.14,39.5 33.14,38.02 34.39,36.77 34.39,28.94 LED1.9 34.39,28.71 34.39,20.54 33.14,19.3 33.14,16.91 34.39,15.66 34.39,7.26 LED2.9
B
  Top 0.254: R13.2 13.73,3.18 13.73,4.31 16.57,7.15 LED2.16
  Bottom 0.254: LED1.16 16.57,28.83 16.57,25.42 15.21,24.06 15.21,23.04 15.44,22.81 15.44,18.05 15.32,17.93 15.32,8.51 16.57,7.26 LED2.16
C
  Top 0.254: R14.2 46.19,3.06 43.36,3.06 42.45,2.16 28.83,2.16 27.81,3.18 27.81,3.63 24.29,7.15 LED2.13
  Bottom 0.254: LED1.13 24.29,28.83 24.29,19.18 25.54,17.93 25.54,8.51 24.29,7.26 LED2.13
COL
  Top 0.254: R21.2 29.28,3.18 29.28,4.65 26.79,7.15 LED2.12
  Bottom 0.254: LED1.12 26.79,25.88 27.01,25.65 27.01,24.52 26.9,24.4 26.9,23.15 28.04,22.02 28.04,8.51 26.79,7.26 LED2.12
D  (via drill 0.36)
  Top 0.254: v23.38,40.86 23.38,40.63 21.79,39.04 LED1.3
  Bottom 0.254: v23.38,40.86 23.38,51.42 28.49,56.52 28.49,56.98 R15.2 | LED2.3 21.68,17.48 21.68,22.93 21,23.61 21,24.52 21.22,24.74 21.22,27.58 20.43,28.38 20.43,37.68 21.68,38.93 LED1.3
DP
  Top 0.254: R19.2 28.49,46.65 28.49,44.72 31.78,41.43 31.78,39.04 LED1.7
  Bottom 0.254: LED2.7 31.89,17.48 31.89,18.73 33.26,20.09 33.26,28.26 33.14,28.38 33.14,37.34 31.89,38.59 31.89,38.93 LED1.7
DTR
  Top 0.254: C9.1 76.61,43.81 80.58,43.81 82.06,42.34 J4.1
E  (via drill 0.36)
  Top 0.254: v26.22,35.98 26.22,38.48 26.67,38.93 LED1.5
  Bottom 0.254: R16.2 28.38,53.8 28.38,51.64 26.79,50.05 26.79,39.04 LED1.5 | v26.22,35.98 25.54,35.3 25.54,28.38 24.97,27.81 24.97,22.25 26.67,20.54 26.67,17.48 LED2.5
F
  Top 0.254: R17.2 36.89,3.18 35.87,3.18 33.03,6.02 30.53,6.02 29.4,7.15 LED2.11
  Bottom 0.254: LED1.11 29.4,28.83 29.4,19.07 30.64,17.82 30.64,8.51 29.4,7.26 LED2.11
G  (via drill 0.36)
  Top 0.254: v9.53,34.5 8.4,35.64 8.4,43.58 9.53,44.72 24.29,44.72 25.65,43.36 28.38,43.36 R18.2
  Bottom 0.254: v9.53,34.5 13.51,34.5 19.07,28.94 LED1.15 19.18,28.71 17.93,27.47 17.93,16.91 19.07,15.78 19.07,7.26 LED2.15
GND  (via drill 0.6)
  Top 0.4: J3.5 79.9,24.06 79,24.06 78.77,24.29 78.77,26.22 82.06,29.51 J4.6 82.06,29.62 82.06,32.01 J4.5 | J2.GND 79.22,11.58 70.37,2.72 70.37,2.5 C1.2 70.14,2.27 63.22,2.27 62.99,2.04 C2.2 62.88,2.16 56.41,2.16 v53.8,4.77 | C3.2 37.8,45.06 37.45,45.06 33.37,49.15 26.45,49.15 24.74,50.85 U1.8 24.52,50.96 23.84,50.96 17.48,57.32 15.55,57.32 14.41,58.45 U1.13 14.53,58.68 16,60.16 16,63.22 J1.2 | RST.3 74.91,63.56 68.44,63.56 RST.4 68.33,63.33 49.94,63.33 49.83,63.22 J8.1 | J5.1 31.89,25.54 35.98,25.54 37.23,24.29 C4.2 37.45,24.29 37.57,24.4 43.92,24.4 C10.2 44.15,24.4 49.37,24.4 50.73,25.77 55.05,25.77 S2.3 55.16,25.88 59.02,25.88 63.33,30.19 LS1.- | S4.3 55.05,6.92 55.05,9.53 53.8,10.78 53.8,14.98 55.05,16.23 S3.3 | C6.1 63.45,44.95 63.45,47.56 U2.8 63.45,47.78 67.19,51.53 67.19,55.84 66.4,56.64 66.4,58.68 64.92,60.16 63.9,60.16 62.65,58.91 61.97,58.91 C5.2 | D1.K 64.47,15.1 64.47,20.54 63.45,21.57 D2.A
  Bottom 0.4: J4.6 82.06,29.51 82.06,14.41 79.34,11.69 J2.GND | 60.95,57.54 60.95,57.88 61.86,58.79 C5.2 | 60.95,57.54 60.95,55.27 U2.22 | 60.95,57.54 57.32,57.54 56.07,58.79 55.39,58.79 C8.2 55.16,59.02 51.08,63.11 49.83,63.11 J8.1 | 64.92,43.36 69.01,43.36 70.26,44.6 70.94,44.6 C7.1 | 64.92,43.36 63.45,44.83 C6.1 | D2.A 63.33,21.68 63.33,30.19 LS1.- 63.45,30.3 63.45,40.18 64.81,41.54 64.81,43.24 64.92,43.36 | S1.3 55.05,35.3 55.05,32.23 53.8,30.98 53.8,27.13 55.05,25.88 S2.3 54.93,25.77 53.8,24.63 53.8,20.32 55.05,19.07 55.05,16.34 S3.3 | C3.2 37.8,44.95 37.8,24.63 37.45,24.29 C4.2 | v53.8,4.77 53.8,5.56 55.05,6.81 S4.3
  pour Bottom: 0,65 84,65 84,0 0,0
N$1
  Top 0.254: R10.1 68.67,10.21 68.67,13.39 67.08,14.98 D1.A
N$2
  Bottom 0.254: R21.1 34.5,3.06 35.53,3.06 37,1.59 52.44,1.59 63.22,12.37 63.22,18.95 68.55,24.29 68.55,31.67 80.36,43.47 80.36,53.57 78.77,55.16 U2.15
N$3
  Bottom 0.254: R14.1 51.42,3.18 51.42,32.58 51.87,33.03 51.87,43.13 51.76,43.24 51.76,46.08 53.23,47.56 U2.4
N$4
  Top 0.254: R15.1 33.71,56.98 35.87,56.98 39.84,53.01 50.39,53.01 55.73,47.67 U2.5
N$5
  Bottom 0.254: R16.1 33.6,53.8 42.9,53.8 45.4,51.3 54.93,51.3 58.34,47.9 58.34,47.67 U2.6
N$6
  Bottom 0.254: R17.1 42.11,3.06 44.83,3.06 45.85,2.04 52.21,2.04 62.77,12.6 62.77,19.18 68.1,24.52 68.1,40.07 74.8,46.76 74.8,48.12 74.11,48.8 72.19,48.8 71.05,47.67 U2.11
N$7
  Bottom 0.254: R18.1 33.6,43.36 34.62,43.36 42.11,50.85 54.71,50.85 57.2,48.35 57.2,47.1 57.88,46.42 72.41,46.42 73.55,47.56 U2.12
N$8
  Top 0.254: R19.1 33.6,46.65 33.82,46.65 43.47,37 68.78,37 74.8,43.02 74.8,46.31 76.05,47.56 U2.13
N$9
  Top 0.254: U2.9 66.06,47.56 66.06,44.95 C6.2 65.94,44.83 65.26,44.15 65.26,40.29 Y1.1
N$10
  Top 0.254: U2.10 68.55,47.56 68.55,44.72 C7.2 68.55,44.6 70.26,42.9 70.26,40.29 Y1.2
N$11
  Bottom 0.254: Q1.1 3.18,36.89 14.53,36.89 16.57,38.93 LED1.1 16.68,39.04 17.48,39.04 18.73,40.29 22.93,40.29 24.18,39.04 LED1.4 24.29,38.93 31.78,31.44 31.78,28.94 LED1.10
N$12
  Top 0.254: Q5.1 3.18,21.57 3.18,24.4 9.65,30.87 9.65,32.91 10.78,34.05 10.78,43.58 11.46,44.27 24.06,44.27 29.28,39.04 LED1.6
N$13
  Bottom 0.254: Q3.1 3.18,29.17 10.44,36.43 16.57,36.43 19.07,38.93 LED1.2
N$14
  Top 0.254: R28.2 82.51,57.09 77.97,57.09 76.16,55.27 U2.16
N$15
  Top 0.254: Q8.1 8.63,22.59 11.46,22.59 16.57,17.48 LED2.1 16.68,17.37 17.48,17.37 18.73,16.12 22.93,16.12 24.18,17.37 LED2.4 24.29,17.37 31.78,9.87 31.78,7.26 LED2.10
N$16
  Bottom 0.254: R28.1 82.51,51.98 82.51,44.49 77.41,39.38 77.41,37.57 70.14,30.3 69.92,30.3 LS1.+ 70.14,30.19 70.94,29.4 70.94,21.68 D2.C
N$17
  Top 0.254: Q6.1 14.41,22.36 14.41,22.13 19.07,17.48 LED2.2
N$18
  Top 0.254: Q4.1 20.2,22.59 21.11,22.59 24.97,18.73 28.04,18.73 29.28,17.48 LED2.6
N$19
  Top 0.254: Q2.1 26.11,22.59 26.9,22.59 30.76,18.73 33.14,18.73 34.39,17.48 LED2.8
N$20
  Bottom 0.254: Q7.1 3.18,14.87 7.26,14.87 16.12,6.02 34.96,6.02 35.64,6.7 35.64,37.8 34.5,38.93 LED1.8
N$21
  Top 0.254: Q1.2 1.25,35.64 1.25,40.29 4.09,43.13 R1.2
N$22
  Top 0.254: Q3.2 1.25,27.92 1.25,33.94 3.18,35.87 3.52,35.87 6.81,39.16 6.81,43.13 R2.2
N$23
  Top 0.254: Q5.2 1.25,20.32 1.25,23.15 9.19,31.1 9.19,33.14 10.21,34.16 10.21,42.45 9.53,43.13 R3.2
N$24
  Top 0.254: Q7.2 1.25,13.62 1.25,18.5 3.18,20.43 3.52,20.43 7.49,24.4 7.49,28.04 10.1,30.64 10.1,32.69 11.8,34.39 11.8,43.13 R4.2
N$25
  Top 0.254: R5.2 14.53,36.43 10.56,32.46 10.56,23.95 Q8.2
N$26
  Top 0.254: Q6.2 16.34,23.72 16.34,26.79 17.93,28.38 17.93,42.22 17.02,43.13 R6.2
N$27
  Top 0.254: R7.2 19.41,43.13 19.41,40.52 20.43,39.5 20.43,26.45 22.02,24.86 22.02,23.95 Q4.2
N$28
  Top 0.254: R8.2 22.25,43.13 25.54,39.84 25.54,27.13 27.81,24.86 27.81,23.95 Q2.2
N$29
  Top 0.254: R1.1 4.2,48.35 4.2,53.34 9.31,58.45 U1.15
N$30
  Top 0.254: R2.1 6.81,48.35 6.81,50.85 U1.1
N$31
  Top 0.254: R3.1 9.42,48.35 9.42,50.85 U1.2
N$32
  Top 0.254: R4.1 11.92,48.35 11.92,50.85 U1.3
N$33
  Top 0.254: R5.1 14.53,50.73 14.41,50.85 U1.4
N$34
  Top 0.254: R6.1 17.02,48.35 17.02,50.85 U1.5
N$35
  Top 0.254: R7.1 19.41,48.35 19.41,50.85 U1.6
N$36
  Top 0.254: R8.1 22.13,48.35 22.13,50.85 U1.7
N$37
  Top 0.254: U2.21 63.33,55.27 62.54,55.27 59.02,58.79 57.88,58.79 C8.1
N$38  (via drill 0.35)
  other vias: 56,13.8
N$39
  Top 0.254: R22.2 37.45,51.64 38.36,51.64 46.08,43.92 J6.1
N$40
  Top 0.254: R23.2 41.2,51.87 41.2,50.39 46.42,45.17 51.76,45.17 53.01,43.92 J7.1
N$46  (via drill 0.36)
  Top 0.254: v68.78,36.32 60.16,36.32 57.88,34.05 44.72,34.05 32.46,46.31 32.46,47.1 33.03,47.67 34.05,47.67 34.62,47.1 34.62,46.53 37.34,43.81 38.48,43.81 39.16,44.49 39.16,45.4 34.28,50.28 33.6,50.28 R20.1
  Bottom 0.254: v68.78,36.32 68.78,37 75.25,43.47 75.25,44.27 78.66,47.67 U2.14
RCK  (via drill 0.36)
  Top 0.254: v37.91,62.99 35.07,60.16 18.61,60.16 17.02,58.57 U1.12
  Bottom 0.254: v37.91,62.99 39.38,64.47 60.49,64.47 67.08,57.88 67.53,57.88 70.14,55.27 70.94,55.27 U2.18
RESET
  Top 0.254: R9.2 76.5,38.02 76.5,41.2 C9.2 | U2.1 45.74,47.56 46.53,47.56 47.67,46.42 56.3,46.42 56.98,47.1 56.98,58 56.64,58.34 56.64,59.36 58,60.72 66.62,60.72 68.33,59.02 RST.2
  Bottom 0.254: RST.2 68.44,59.02 74.91,59.02 RST.1 74.91,58.91 74.91,54.82 79.9,49.83 79.9,45.51 76.61,42.22 76.61,41.31 C9.2
RX
  Bottom 0.254: 33.37,5.11 35.87,5.11 42.79,12.03 42.79,42.34 48.12,47.67 U2.2 | 33.37,5.11 29.85,5.11 27.92,3.18 26.79,3.18 R12.1 | 33.37,5.11 33.37,2.72 34.96,1.14 54.82,1.14 60.16,6.47 60.16,8.17 63.22,11.24 65.15,11.24 72.3,18.39 72.3,26.67 82.06,36.43 82.06,37.11 J4.3
S1
  Top 0.254: S1.1 55.16,39.84 56.3,38.7 58.79,38.7 R24.1 58.79,38.82 59.59,39.61 59.59,48.01 58.45,49.15 58.45,55.16 U2.23
  Bottom 0.254: J1.10 36.43,63.22 36.66,63.22 39.73,60.16 52.32,60.16 56.07,56.41 57.2,56.41 58.34,55.27 U2.23
S2  (via drill 0.36)
  Top 0.254: R25.1 59.02,29.74 55.73,29.74 55.16,30.3 S2.1 55.05,30.42 54.14,30.42 v51.19,33.37 | v54.25,50.17 54.25,53.69 55.73,55.16 U2.24
  Bottom 0.254: U2.24 55.73,55.27 54.93,55.27 50.51,59.7 37.34,59.7 33.82,63.22 J1.9 | v51.19,33.37 51.19,46.42 52.1,47.33 52.1,48.12 54.14,50.17 v54.25,50.17
S3
  Top 0.254: S3.1 55.16,20.88 59.02,20.88 R26.1 59.02,21 59.02,23.04 75.25,39.27 75.25,45.06 77.29,47.1 77.29,49.83 72.19,54.93 72.19,57.54 68.55,61.18 56.86,61.18 55.73,60.04 54.82,60.04 53.34,58.57 53.34,55.27 U2.25
  Bottom 0.254: U2.25 53.23,55.27 52.32,55.27 48.35,59.25 35.3,59.25 31.33,63.22 J1.8
S4  (via drill 0.36)
  Top 0.254: R27.1 59.02,11.8 55.5,11.8 55.16,11.46 S4.1 | v54.93,53.12 v54.93,49.6
  Bottom 0.254: J1.7 28.83,63.22 29.17,63.22 33.6,58.79 46.31,58.79 49.83,55.27 50.62,55.27 U2.26 50.85,55.27 53.01,53.12 v54.93,53.12 | v54.93,49.6 54.59,49.26 54.59,47.22 60.72,41.09 60.72,16 59.13,14.41 59.13,11.92 R27.1
SCK  (via drill 0.36)
  Top 0.254: v28.6,59.47 25.31,59.47 25.08,59.7 20.66,59.7 19.52,58.57 U1.11
  Bottom 0.254: v28.6,59.47 32.35,55.73 42.34,55.73 45.63,52.44 64.81,52.44 67.53,55.16 68.44,55.16 U2.19
SCL
  Top 0.254: 42.22,56.98 43.92,56.98 45.63,55.27 U2.28 | 42.22,56.98 41.2,56.98 R23.1 | 42.22,56.98 42.22,63.11 J8.4 42.11,63.22 40.75,64.58 23.15,64.58 21.91,63.33 21.11,63.33 J1.4
SDA
  Top 0.254: R22.1 37.45,56.75 39.95,56.75 42.68,54.03 46.99,54.03 48.12,55.16 U2.27 48.12,55.27 44.83,58.57 44.83,63.11 J8.3
  Bottom 0.254: J1.3 18.61,63.22 19.3,63.22 22.36,60.16 31.55,60.16 33.71,58 36.21,58 37.34,56.86 R22.1
SEG_COMMON
  Top 0.4: 20.2,24.29 20.2,25.08 Q4.3 | 20.2,24.29 21.68,22.81 23.72,22.81 25.99,25.08 Q2.3 25.65,24.63 27.47,22.81 28.38,22.81 28.6,23.04 31.78,23.04 J5.2 | Q7.3 3.18,12.37 3.18,13.39 4.2,14.41 4.2,17.82 3.18,18.84 Q5.3 | Q1.3 3.18,34.28 3.18,30.64 4.2,29.62 4.2,27.58 3.18,26.56 Q3.3 | 20.2,24.29 20.09,24.18 18.27,24.18 16.68,22.59 15.89,22.59 14.41,24.06 14.41,24.97 Q6.3
  Bottom 0.4: 4.2,26.45 7.26,26.45 8.51,25.2 Q8.3 8.74,25.08 14.3,25.08 Q6.3 | 4.2,26.45 3.18,26.45 Q3.3 | 4.2,26.45 4.2,21 3.18,19.98 3.18,18.95 Q5.3
SER
  Bottom 0.254: U2.17 73.55,55.16 72.64,55.16 69.46,51.98 45.4,51.98 42.11,55.27 31.78,55.27 27.35,59.7 13.05,59.7 11.92,58.57 U1.14
TX  (via drill 0.36)
  Top 0.254: v42.11,12.37 44.95,12.37 51.76,5.56 55.73,5.56 55.96,5.79 65.83,5.79 69.8,9.76 69.8,14.3 77.41,21.91 77.41,34.28 82.06,38.93 82.06,39.61 J4.2
  Bottom 0.254: 42.05,12.43 42.34,12.71 42.34,42.68 46.99,47.33 46.99,48.12 47.67,48.8 49.49,48.8 50.62,47.67 U2.3 | 42.05,12.43 35.19,5.56 22.59,5.56 20.2,3.18 18.84,3.18 R13.1 | v42.11,12.37 42.05,12.43

### Text on the board
tNames: 5V | GND | SDA | SCL | S4 | S3 | S2 | S1 | SCL | SDA | 5V | GND | 7 segment ver. 1.1 | DTR | GND | 5V